# EAGLE board SteppyMk2_10x10 (EAGLE 9.2.2), part 1 of 2
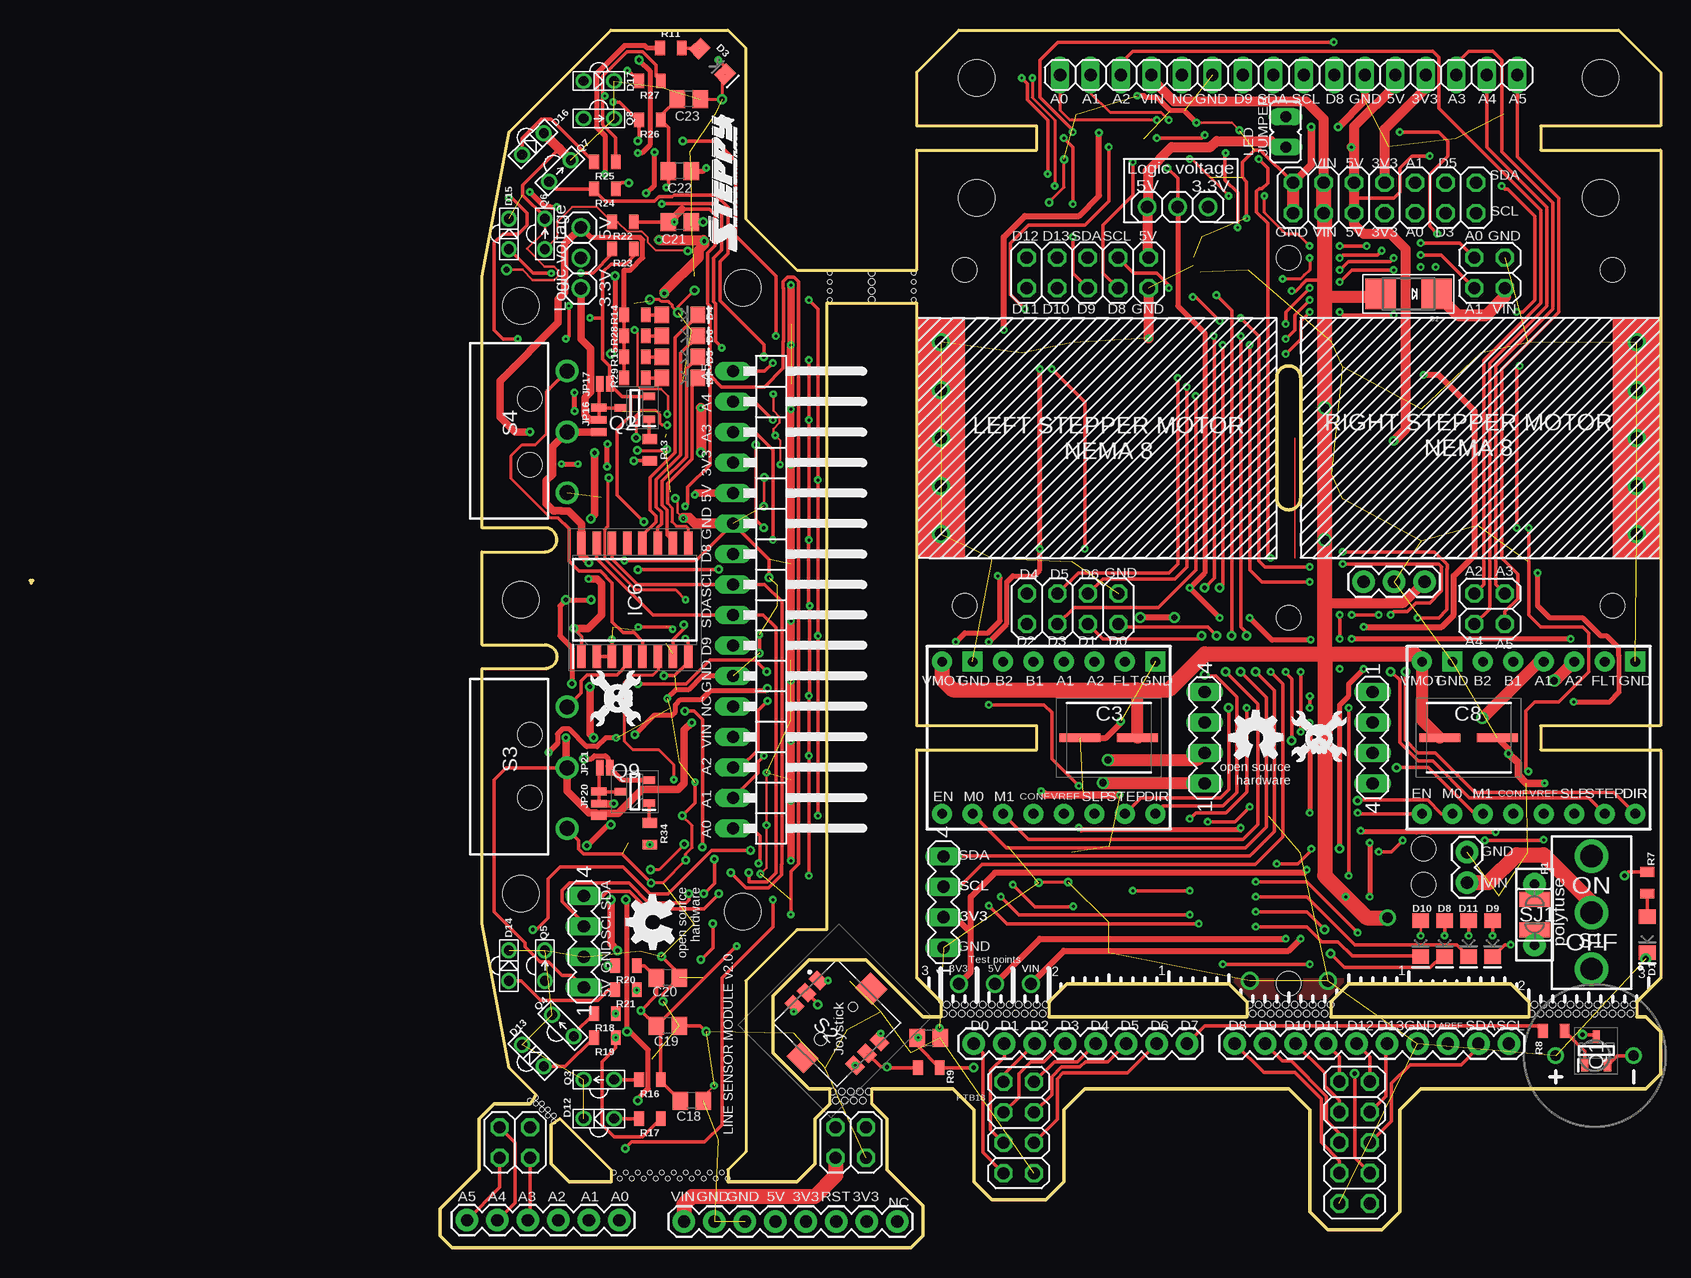
[diagram p1: board, top side]
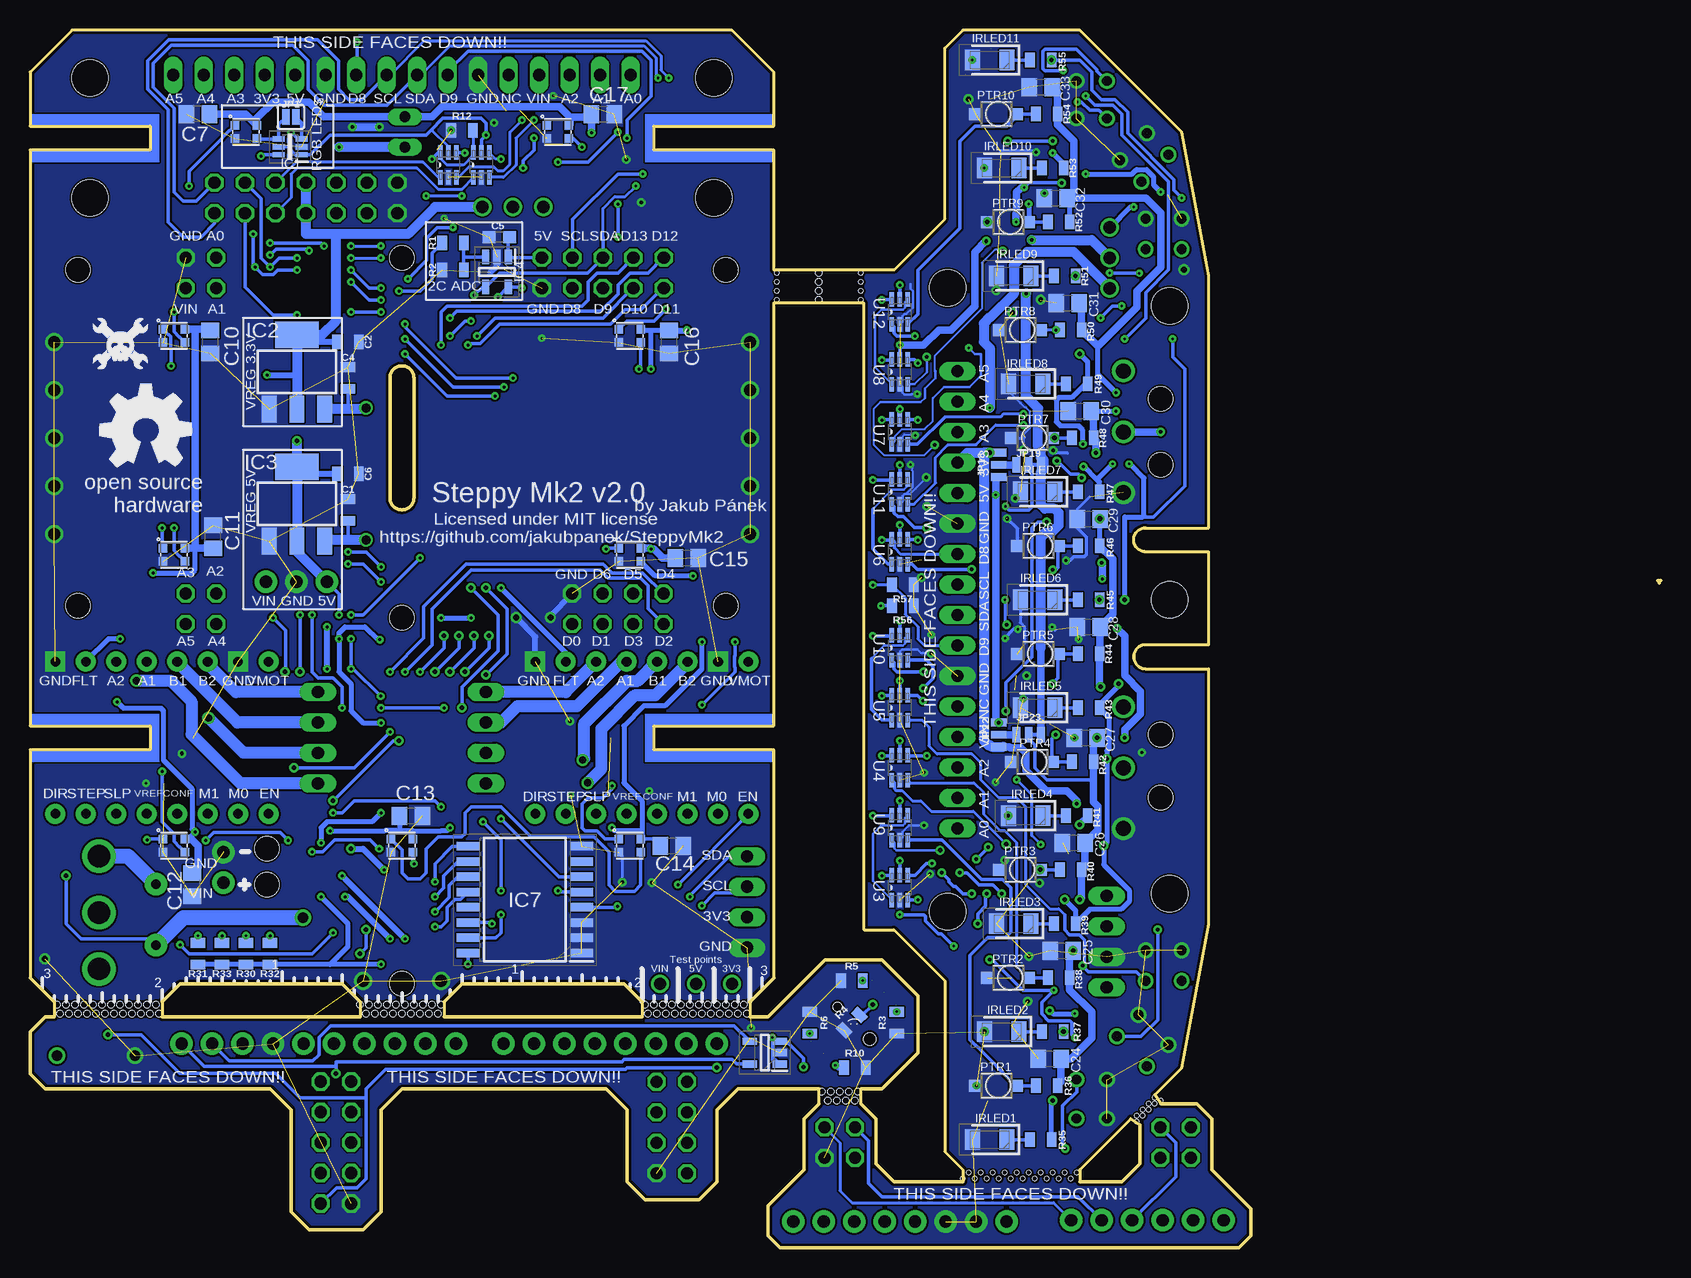
[diagram p2: board, bottom side, seen from below]

Size 135.92 x 101.5 mm. Coordinates in mm from the lower left corner, seen from the top.
Outline: 0,55.61 0.23,55.61
Outline: 0.1,55.59 0.1,55.41
Outline: 66.42,26.5 66.42,78.75 73.92,78.75 73.92,43.5 83.92,43.5 83.92,41.5 73.92,41.5 73.92,22.5 75.92,20.5 75.92,19.25 74.42,19.25 69.67,24 64.92,24 61.92,21 61.92,16.25 64.92,13.25 66.67,13.25 66.67,12 65.42,10.75 65.42,7 63.92,5.5 58.17,5.5 58.17,6.5 59.67,8 59.67,22.25 63.92,26.5 66.42,26.5
Outline: 63.92,81.5 59.67,85.75 59.67,100 58.17,101.5 48.42,101.5 39.92,93 37.67,81 37.67,60 42.92,60 arc-90 43.92,59 arc-90 42.92,58 37.67,58 37.67,50.25 42.92,50.25 arc-90 43.92,49.25 arc-90 42.92,48.25 37.67,48.25 37.67,27 39.92,15 42.17,12.75 41.67,12 38.67,12 37.42,10.75 37.42,6.5 34.17,3.25 34.17,1 35.17,0 73.42,0 74.42,1 74.42,3.5 71.42,6.5 71.42,10.75 70.17,12 70.17,13.25 76.92,13.25 78.67,11.5 78.67,5.5 80.17,4 84.67,4 86.17,5.5 86.17,11.5 87.92,13.25 104.92,13.25 106.67,11.5 106.67,3 108.17,1.5 112.67,1.5 114.17,3 114.17,11.5 115.92,13.25 134.67,13.25 135.92,14.5 135.92,18 134.67,19.25 133.92,19.25 133.92,20.5 135.92,22.5 135.92,41.5 125.92,41.5 125.92,43.5 135.92,43.5 135.92,91.5 125.92,91.5 125.92,93.5 135.92,93.5 135.92,98 132.42,101.5 77.42,101.5 73.92,98 73.92,93.5 83.92,93.5 83.92,91.5 73.92,91.5 73.92,81.5 63.92,81.5
Outline: 84.92,19.25 101.42,19.25 101.42,20.5 99.92,22 86.42,22 84.92,20.5 84.92,19.25
Outline: 108.42,19.25 124.92,19.25 124.92,20.5 123.42,22 109.92,22 108.42,20.5 108.42,19.25
Outline: 48.42,5.5 44.92,5.5 43.42,7 43.42,10.25 44.17,10.75 48.42,6.5 48.42,5.5
Outline: 103.92,62.5 103.92,72.5 arc-90 104.92,73.5 arc-90 105.92,72.5 105.92,62.5 arc-90 104.92,61.5 arc-90 103.92,62.5
Copper layers (1*16): Top 0.035mm / dielectric 1.5mm / Bottom 0.035mm
Design rules "default *": minimum track width 6mil, minimum drill 0.2mm, track to track 6mil, track to pad 6mil, pad to pad 6mil, via to via 6mil, smd to smd 6mil, copper to edge 0.2mm, drill to drill 6mil, minimum pad ring 10mil, minimum via ring 8mil, stop-mask expansion 4mil, vias tented up to drill 0mil, thermal gap 10mil
Holes 2 mm at 104.92,52.5 104.92,82.5 41.67,65.25 41.67,70.75 41.67,37.5 41.67,42.75 104.92,22 116.17,33.25 116.17,30.25 77.92,53.5 77.92,81.5 131.92,53.5 131.92,81.5
Holes 3 mm at 130.92,97.5 78.92,97.5 59.42,28 59.42,80 40.92,29.5 40.92,78.5 78.92,87.5 130.92,87.5 40.92,54
Holes 0.35 mm at 66.67,79 66.67,79.75 66.67,80.5 66.67,81.25 73.67,81.25 73.67,79 73.67,79.75 73.67,80.5 48.67,6.25 49.67,6.25 49.17,5.75 50.17,5.75 51.17,5.75 52.17,5.75 53.17,5.75 54.17,5.75 55.17,5.75 56.17,5.75 57.17,5.75 58.17,5.75 57.67,6.25 56.67,6.25 55.67,6.25 54.67,6.25 53.67,6.25 52.67,6.25 51.67,6.25 50.67,6.25 42.17,12.5 42.67,12 43.17,11.5 43.67,11 43.17,11 42.67,11.5 42.17,12 43.67,10.5 41.67,12.25
Holes 0.5 mm at 76.17,19.5 76.92,19.5 77.67,19.5 78.42,19.5 79.17,19.5 79.92,19.5 80.67,19.5 81.42,19.5 82.17,19.5 82.92,19.5 83.67,19.5 84.42,19.5 84.67,20.25 83.92,20.25 83.17,20.25 82.42,20.25 81.67,20.25 80.92,20.25 80.17,20.25 79.42,20.25 78.67,20.25 77.92,20.25 77.17,20.25 76.42,20.25 101.92,19.5 102.67,19.5 101.67,20.25 102.42,20.25 103.17,20.25 103.92,20.25 104.67,20.25 105.42,20.25 106.17,20.25 106.92,20.25 107.67,20.25 108.42,20.25 103.42,19.5 104.17,19.5 104.92,19.5 105.67,19.5 106.42,19.5 107.17,19.5 107.92,19.5 125.17,19.5 125.42,20.25 125.92,19.5 126.17,20.25 126.67,19.5 126.92,20.25 127.42,19.5 127.67,20.25 128.17,19.5 128.42,20.25 128.92,19.5 129.17,20.25 129.67,19.5 129.92,20.25 130.42,19.5 130.67,20.25 131.17,19.5 131.42,20.25 131.92,19.5 132.17,20.25 132.92,20.25 132.67,19.5 133.42,19.5 133.67,20.25 70.17,81.25 70.17,80.5 70.17,79.75 70.17,79 67.17,12.25 67.92,12.25 68.67,12.25 69.42,12.25 69.92,13 69.17,13 68.42,13 67.67,13 66.92,13

## Footprints (pad centres in the part's own frame; a part is rotated, then mirrored left to right if it is on the bottom)
0805 = smd 0.8 x 1.2: 1 -0.9,0; 2 0.9,0
CAPM7058X610N = smd 3.4 x 0.7: 1 -2.4,0; 2 2.4,0
0603 = smd 1.1 x 1: 1 -0.85,0; 2 0.85,0
C0805 = smd 1.3 x 1.5: 1 -0.95,0; 2 0.95,0
LED-1206 = smd 1.2 x 1.4: A -1.5,0; C 1.5,0
SMADIODE = smd 2.54 x 2.54: A 2.349,0; C -2.349,0
LTE-302 = drill 0.8: A 1.27,0; C -1.27,0
POLOLU-DRV8825 = drill 0.8 pad 1.676: A1 6.35,-1.27; A2 6.35,-3.81; B1 6.35,1.27; B2 6.35,3.81; CONFIG -6.35,1.27; DIR -6.35,-8.89; EN -6.35,8.89; FLT 6.35,-6.35; M0 -6.35,6.35; M1 -6.35,3.81; SLP -6.35,-3.81; STEP -6.35,-6.35; VMOT 6.35,8.89; VREF -6.35,-1.27 | drill 0.8 pad 1.676 square: GND0 6.35,6.35; GND1 6.35,-8.89
PTH = drill 0.8 pad 1.88: P$1 -2.54,0; P$2 2.54,0
SOT65P210X110-6N = smd 1 x 0.45: 1 -0.95,0.65; 2 -0.95,0; 3 -0.95,-0.65; 4 0.95,-0.65; 5 0.95,0; 6 0.95,0.65
SOT223 = smd 1.219 x 2.235: 1 -2.311,-3.099; 2 0,-3.099; 3 2.311,-3.099 | smd 3.6 x 2.2: TAB 0,3.099
SOT95P280X145-5N = smd 1.2 x 0.6: 1 -1.25,0.95; 2 -1.25,0; 3 -1.25,-0.95; 4 1.25,-0.95; 5 1.25,0.95
SOIC127P1032X265-16N = smd 1.95 x 0.7: 1 -4.725,4.445; 2 -4.725,3.175; 3 -4.725,1.905; 4 -4.725,0.635; 5 -4.725,-0.635; 6 -4.725,-1.905; 7 -4.725,-3.175; 8 -4.725,-4.445; 9 4.725,-4.445; 10 4.725,-3.175; 11 4.725,-1.905; 12 4.725,-0.635; 13 4.725,0.635; 14 4.725,1.905; 15 4.725,3.175; 16 4.725,4.445
LEDC3215X130N = smd 1.25 x 1.7: 1 -1.45,0; 2 1.45,0
1X02 = drill 1.016 pad 1.88: 1 0,0; 2 2.54,0
1X08 = drill 1.016 pad 1.88: 1 0,0; 2 2.54,0; 3 5.08,0; 4 7.62,0; 5 10.16,0; 6 12.7,0; 7 15.24,0; 8 17.78,0
1X06 = drill 1.016 pad 1.88: 1 0,0; 2 2.54,0; 3 5.08,0; 4 7.62,0; 5 10.16,0; 6 12.7,0
1X10 = drill 1.016 pad 1.88: 1 0,0; 2 2.54,0; 3 5.08,0; 4 7.62,0; 5 10.16,0; 6 12.7,0; 7 15.24,0; 8 17.78,0; 9 20.32,0; 10 22.86,0
1X03 = drill 1.016 pad 1.88: 1 0,0; 2 2.54,0; 3 5.08,0
SMT-JUMPER_2_NC_PASTE_SILK = smd 0.635 x 1.27: 1 -0.406,0; 2 0.406,0
JP1 = drill 0.914 long: 1 0,-1.27; 2 0,1.27
2X02 = drill 1.016 octagon: 1 -1.27,-1.27; 2 -1.27,1.27; 3 1.27,-1.27; 4 1.27,1.27
2X07 = drill 1.016 octagon: 1 -7.62,-1.27; 2 -7.62,1.27; 3 -5.08,-1.27; 4 -5.08,1.27; 5 -2.54,-1.27; 6 -2.54,1.27; 7 0,-1.27; 8 0,1.27; 9 2.54,-1.27; 10 2.54,1.27; 11 5.08,-1.27; 12 5.08,1.27; 13 7.62,-1.27; 14 7.62,1.27
2X05 = drill 1.016 octagon: 1 -5.08,-1.27; 2 -5.08,1.27; 3 -2.54,-1.27; 4 -2.54,1.27; 5 0,-1.27; 6 0,1.27; 7 2.54,-1.27; 8 2.54,1.27; 9 5.08,-1.27; 10 5.08,1.27
2X04 = drill 1.016 octagon: 1 -3.81,-1.27; 2 -3.81,1.27; 3 -1.27,-1.27; 4 -1.27,1.27; 5 1.27,-1.27; 6 1.27,1.27; 7 3.81,-1.27; 8 3.81,1.27
1X16/90 = drill 1.016 long: 1 -19.05,-3.81; 2 -16.51,-3.81; 3 -13.97,-3.81; 4 -11.43,-3.81; 5 -8.89,-3.81; 6 -6.35,-3.81; 7 -3.81,-3.81; 8 -1.27,-3.81; 9 1.27,-3.81; 10 3.81,-3.81; 11 6.35,-3.81; 12 8.89,-3.81; 13 11.43,-3.81; 14 13.97,-3.81; 15 16.51,-3.81; 16 19.05,-3.81
1X16 = drill 1.016 long: 1 -19.05,0; 2 -16.51,0; 3 -13.97,0; 4 -11.43,0; 5 -8.89,0; 6 -6.35,0; 7 -3.81,0; 8 -1.27,0; 9 1.27,0; 10 3.81,0; 11 6.35,0; 12 8.89,0; 13 11.43,0; 14 13.97,0; 15 16.51,0; 16 19.05,0
1X03' = drill 1.016: 1 -2.54,0; 2 0,0; 3 2.54,0
SMT-JUMPER_3_1-NC_TRACE_NO-SILK = smd 0.635 x 1.27: 1 -1.016,0; 2 0,0; 3 1.016,0
SMT-JUMPER_2_NO_NO-SILK = smd 0.635 x 1.27: 1 -0.406,0; 2 0.406,0
SMT-JUMPER_3_0-NO_TRACE_NO-SILK = smd 0.635 x 1.27: 1 -1.016,0; 2 0,0; 3 1.016,0
BUZZER-12MM-NS = drill 0.9: + 3.25,0; - -3.25,0
WS2812-2020 = smd 0.7 x 0.7: 1 0.915,-0.55; 2 0.915,0.55; 3 -0.915,0.55; 4 -0.915,-0.55
TEMT1020 = smd 1.1 x 1: 1 -1.7,0; 2 1.7,0
SOT96P237X111-3N = smd 1 x 0.6: 1 -1.2,0.955; 2 -1.2,-0.955; 3 1.2,0
LTR-301 = drill 0.8: C 1.27,0; E -1.27,0
5MS1S102AM2QES = drill 1.85 pad 2.8: 1 0,-4.7; 2 0,0; 3 0,4.7
SKRHABE010 = smd 1.35 x 1: 1 -3.575,1.425; 2 -3.575,0; 3 -3.575,-1.425; 4 3.575,1.425; 5 3.575,0; 6 3.575,-1.425 | smd 2 x 1.8: 7 0,4.05; 8 0,-4.05 | hole 0.75: 0,1.9 | hole 1.05: 0,-1.9
AH186061A = drill 1.25 pad 1.9: 1 -5.08,1.6; 2 0,1.6; 3 5.08,1.6
SJW = smd 1.27 x 2.54: 1 -1.27,0; 2 1.27,0
MA04-1 = drill 1.016 long: 1 -3.81,0; 2 -1.27,0; 3 1.27,0; 4 3.81,0
SOT65P210X110-6N' = smd 1.168 x 0.356: 1 -1.041,0.66; 2 -1.041,0; 3 -1.041,-0.66; 4 1.041,-0.66; 5 1.041,0; 6 1.041,0.66

## Placement (x,y rotation side)
C1  10uF  [0805]  109.42,61.5 90 bottom
C2  10uF  [0805]  109.42,75.5 0 bottom
C3  100UF  [CAPM7058X610N]  89.92,42.5 0 top
C4  10uF  [0805]  109.42,72.5 90 bottom
C5  0.1uF  [0603]  96.8,84.23 180 bottom
C6  10uF  [0805]  109.42,64.5 0 bottom
C7  0.1uF  [C0805]  121.92,94.5 180 bottom
C8  100UF  [CAPM7058X610N]  119.92,42.5 180 top
C9  0.1uF  [C0805]  74.92,17.5 0 top
C10  0.1uF  [C0805]  120.92,75.5 270 bottom
C11  0.1uF  [C0805]  120.67,59.25 90 bottom
C12  0.1uF  [C0805]  122.42,30.25 270 bottom
C13  0.1uF  [C0805]  104.17,36 0 bottom
C14  0.1uF  [C0805]  82.42,33.5 0 bottom
C15  0.1uF  [C0805]  81.17,57.5 0 bottom
C16  0.1uF  [C0805]  82.67,75.5 270 bottom
C17  0.1uF  [C0805]  88.17,94.5 0 bottom
C18  [C0805]  55.17,12.25 180 top
C19  [C0805]  53.17,18.5 180 top
C20  [C0805]  53.17,22.5 180 top
C21  [C0805]  54.17,85.5 180 top
C22  [C0805]  54.17,89.75 180 top
C23  [C0805]  54.92,95.75 180 top
C24  [C0805]  50.92,15.75 0 bottom
C25  [C0805]  49.92,24.75 0 bottom
C26  [C0805]  48.92,33.75 0 bottom
C27  [C0805]  47.92,42.5 0 bottom
C28  [C0805]  47.67,51.75 0 bottom
C29  [C0805]  47.67,60.75 0 bottom
C30  [C0805]  48.42,69.75 0 bottom
C31  [C0805]  49.42,78.75 0 bottom
C32  [C0805]  50.42,87.5 0 bottom
C33  [C0805]  51.67,96.75 0 bottom
D1  GREEN  [LED-1206]  134.82,26.1 270 top
D2  [SMADIODE]  114.92,79.5 180 top
D3  GREEN  [LED-1206]  56.87,98.89 315 top
D4  GREEN  [LED-1206]  54.17,77.75 0 top
D5  GREEN  [LED-1206]  54.17,74.25 0 top
D6  GREEN  [LED-1206]  54.17,76 0 top
D7  GREEN  [LED-1206]  54.17,72.5 0 top
D8  GREEN  [LED-1206]  117.92,25.75 270 top
D9  GREEN  [LED-1206]  121.92,25.75 270 top
D10  GREEN  [LED-1206]  115.92,25.75 270 top
D11  GREEN  [LED-1206]  119.92,25.75 270 top
D12  [LTE-302]  47.42,10.75 0 top
D13  [LTE-302]  41.92,16 315 top
D14  [LTE-302]  39.92,23.5 270 top
D15  [LTE-302]  39.92,84.5 270 top
D16  [LTE-302]  41.92,92 225 top
D17  [LTE-302]  47.42,97.25 180 top
DRV1  POLOLU-DRV8825  [POLOLU-DRV8825]  124.92,42.5 90 top
DRV2  POLOLU-DRV8825  [POLOLU-DRV8825]  84.92,42.5 90 top
F1  [PTH]  125.42,27.75 270 top
GOLD_ORB_SM1  OSHWLOGOLOGO8MM  [OSHW_8MM]  126.29,68.12 0 bottom
GOLD_ORB_SM2  OSHWLOGOLOGO5MM  [OSHW_5MM]  102.17,42.5 0 top
GOLD_ORB_SM3  OSHWLOGOLOGO5MM  [OSHW_5MM]  51.92,27.12 90 top
IC1  74LVC1T45GW,125  [SOT65P210X110-6N]  114.24,91.76 180 bottom
IC2  AP1117E33G-13  [SOT223]  113.67,73 0 bottom
IC3  TS1117BCW-5.0  [SOT223]  113.67,62 0 bottom
IC4  MCP3021A0T-E_OT  [SOT95P280X145-5N]  97,81.33 270 bottom
IC5  MCP3021A1T-E_OT  [SOT95P280X145-5N]  74.67,16.25 180 bottom
IC6  PCF8574T_3,518  [SOIC127P1032X265-16N]  50.42,54 90 top
IC7  PCF8574T_3,518  [SOIC127P1032X265-16N]  94.67,29 180 bottom
IRLED1  LL-S150IRC-2A  [LEDC3215X130N]  55.92,9 180 bottom
IRLED2  LL-S150IRC-2A  [LEDC3215X130N]  54.92,18 180 bottom
IRLED3  LL-S150IRC-2A  [LEDC3215X130N]  53.92,27 180 bottom
IRLED4  LL-S150IRC-2A  [LEDC3215X130N]  52.92,36 180 bottom
IRLED5  LL-S150IRC-2A  [LEDC3215X130N]  51.92,45 180 bottom
IRLED6  LL-S150IRC-2A  [LEDC3215X130N]  51.92,54 180 bottom
IRLED7  LL-S150IRC-2A  [LEDC3215X130N]  51.92,63 180 bottom
IRLED8  LL-S150IRC-2A  [LEDC3215X130N]  52.92,72 180 bottom
IRLED9  LL-S150IRC-2A  [LEDC3215X130N]  53.92,81 180 bottom
IRLED10  LL-S150IRC-2A  [LEDC3215X130N]  54.92,90 180 bottom
IRLED11  LL-S150IRC-2A  [LEDC3215X130N]  55.92,99 180 bottom
J1  [1X02]  119.79,32.96 270 top
J2  [1X08]  72.3,2.16 180 top
J3  [1X06]  49.13,2.28 180 top
J4  [1X10]  100.42,17 0 top
J5  [1X08]  78.67,17 0 top
J6  455-1750-1-ND  [1X03]  111.17,55.5 0 top
JP1  JUMPER-SMT_2_NC_PASTE_SILK  [SMT-JUMPER_2_NC_PASTE_SILK]  114.17,94.25 180 bottom
JP2  [JP1]  104.67,93 180 top
JP3  [2X02]  68.42,8.75 180 top
JP4  [2X02]  40.42,8.75 180 top
JP5  [2X07]  112.92,87.5 180 top
JP6  [2X05]  110.42,8.75 90 top
JP7  [2X04]  82.42,10 90 top
JP8  [2X02]  121.67,81.25 270 top
JP9  [2X02]  121.67,53.25 270 top
JP10  [2X05]  88.17,81.25 180 top
JP11  [2X04]  86.92,53.25 180 top
JP12  [1X16/90]  62.42,54 270 top
JP13  [1X16]  104.92,97.75 0 top
JP14  [1X03']  45.92,82.5 90 top
JP15  [1X03']  95.67,86.75 180 top
JP16  JUMPER-SMT_3_1-NC_TRACE_NO-SILK  [SMT-JUMPER_3_1-NC_TRACE_NO-SILK]  47.42,69 90 top
JP17  JUMPER-SMT_2_NO_NO-SILK  [SMT-JUMPER_2_NO_NO-SILK]  47.92,72 180 top
JP18  JUMPER-SMT_3_NO_NO_SILK  [SMT-JUMPER_3_0-NO_TRACE_NO-SILK]  55.17,65.25 90 bottom
JP19  JUMPER-SMT_3_1-NC_TRACE_NO-SILK  [SMT-JUMPER_3_1-NC_TRACE_NO-SILK]  52.67,65.25 0 bottom
JP20  JUMPER-SMT_3_1-NC_TRACE_NO-SILK  [SMT-JUMPER_3_1-NC_TRACE_NO-SILK]  47.42,37 90 top
JP21  JUMPER-SMT_2_NO_NO-SILK  [SMT-JUMPER_2_NO_NO-SILK]  47.92,40 180 top
JP22  JUMPER-SMT_3_NO_NO_SILK  [SMT-JUMPER_3_0-NO_TRACE_NO-SILK]  55.17,42.75 270 bottom
JP23  JUMPER-SMT_3_1-NC_TRACE_NO-SILK  [SMT-JUMPER_3_1-NC_TRACE_NO-SILK]  52.67,42.75 0 bottom
LS1  BUZZER-PTH_NO_SILK  [BUZZER-12MM-NS]  130.42,16 180 top
PLED1  WS2812-2020  [WS2812-2020]  117.92,93 180 bottom
PLED2  WS2812-2020  [WS2812-2020]  123.92,76 180 bottom
PLED3  WS2812-2020  [WS2812-2020]  123.92,57.75 180 bottom
PLED4  WS2812-2020  [WS2812-2020]  123.92,33.5 180 bottom
PLED5  WS2812-2020  [WS2812-2020]  104.92,33.5 180 bottom
PLED6  WS2812-2020  [WS2812-2020]  85.92,33.5 180 bottom
PLED7  WS2812-2020  [WS2812-2020]  85.92,57.75 180 bottom
PLED8  WS2812-2020  [WS2812-2020]  85.92,76 180 bottom
PLED9  WS2812-2020  [WS2812-2020]  91.92,93 180 bottom
PTR1  TEMT1020  [TEMT1020]  55.42,13.5 180 bottom
PTR2  TEMT1020  [TEMT1020]  54.42,22.5 180 bottom
PTR3  TEMT1020  [TEMT1020]  53.42,31.5 180 bottom
PTR4  TEMT1020  [TEMT1020]  52.42,40.5 180 bottom
PTR5  TEMT1020  [TEMT1020]  51.92,49.5 180 bottom
PTR6  TEMT1020  [TEMT1020]  51.92,58.5 180 bottom
PTR7  TEMT1020  [TEMT1020]  52.42,67.5 180 bottom
PTR8  TEMT1020  [TEMT1020]  53.42,76.5 180 bottom
PTR9  TEMT1020  [TEMT1020]  54.42,85.5 180 bottom
PTR10  TEMT1020  [TEMT1020]  55.42,94.5 180 bottom
Q1  SBC817-40LT1G  [SOT96P237X111-3N]  130.55,16.4 90 top
Q2  SBC817-40LT1G  [SOT96P237X111-3N]  50.42,70 180 top
Q3  [LTR-301]  47.42,14 0 top
Q4  [LTR-301]  44.42,18.5 315 top
Q5  [LTR-301]  42.92,23.5 270 top
Q6  [LTR-301]  42.92,84.5 270 top
Q7  [LTR-301]  44.17,89.75 225 top
Q8  [LTR-301]  47.42,94.12 180 top
Q9  SBC817-40LT1G  [SOT96P237X111-3N]  50.42,38 180 top
R1  10K  [0805]  100.67,83.75 0 bottom
R2  10K  [0805]  100.67,81.5 180 bottom
R3  8k2  [0805]  63.67,18.75 90 bottom
R4  4k7  [0805]  67.42,18.75 45 bottom
R5  2k  [0805]  67.42,22.25 0 bottom
R6  16k  [0805]  70.92,18.75 270 bottom
R7  4K7  [0805]  134.81,30.41 270 top
R8  4.7K  [0805]  127,18.06 180 top
R9  1M  [0805]  74.92,15 0 top
R10  33k  [0805]  67.17,15 0 bottom
R11  330  [0805]  53.42,100 0 top
R12  330K  [0805]  99.92,93.12 0 bottom
R13  4.7K  [0805]  51.67,66.5 270 top
R14  4k7  [0805]  50.42,77.75 0 top
R15  4k7  [0805]  50.42,74.25 0 top
R16  10K  [0805]  51.67,14 180 top
R17  330  [0805]  51.67,10.75 180 top
R18  10K  [0805]  47.92,19.5 180 top
R19  330  [0805]  47.92,17.5 180 top
R20  10K  [0805]  49.67,23.5 180 top
R21  330  [0805]  49.67,21.5 180 top
R22  10K  [0805]  49.42,85.5 180 top
R23  330  [0805]  49.42,83.25 180 top
R24  10K  [0805]  47.92,88.25 180 top
R25  330  [0805]  47.92,90.5 180 top
R26  10K  [0805]  51.67,94 180 top
R27  330  [0805]  51.67,97.25 180 top
R28  4k7  [0805]  50.42,76 0 top
R29  4k7  [0805]  50.42,72.5 0 top
R30  4k7  [0805]  117.92,24.5 90 bottom
R31  4k7  [0805]  121.92,24.5 90 bottom
R32  4k7  [0805]  115.92,24.5 90 bottom
R33  4k7  [0805]  119.92,24.5 90 bottom
R34  4.7K  [0805]  51.67,34.5 270 top
R35  330  [0805]  51.67,9 180 bottom
R36  10K  [0805]  51.17,13.5 180 bottom
R37  330  [0805]  50.67,18 180 bottom
R38  10K  [0805]  50.17,22.5 180 bottom
R39  330  [0805]  49.67,27 180 bottom
R40  10K  [0805]  49.17,31.5 180 bottom
R41  330  [0805]  48.67,36 180 bottom
R42  10K  [0805]  48.17,40.5 180 bottom
R43  330  [0805]  47.67,45 180 bottom
R44  10K  [0805]  47.67,49.5 180 bottom
R45  330  [0805]  47.67,54 180 bottom
R46  10K  [0805]  47.67,58.5 180 bottom
R47  330  [0805]  47.67,63 180 bottom
R48  10K  [0805]  48.17,67.5 180 bottom
R49  330  [0805]  48.67,72 180 bottom
R50  10K  [0805]  49.17,76.5 180 bottom
R51  330  [0805]  49.67,81 180 bottom
R52  10K  [0805]  50.17,85.5 180 bottom
R53  330  [0805]  50.67,90 180 bottom
R54  10K  [0805]  51.17,94.5 180 bottom
R55  330  [0805]  51.67,99 180 bottom
R56  330K  [0805]  63.17,53.5 180 bottom
R57  330K  [0805]  63.17,55.25 180 bottom
S1  5MS1S102AM2QES  [5MS1S102AM2QES]  130.16,27.92 0 top
S2  SKRHABE010  [SKRHABE010]  67.26,18.72 315 top
S3  AH186061A  [AH186061A]  43.17,40 270 top
S4  AH186061A  [AH186061A]  43.17,68 270 top
SJ1  [SJW]  125.42,27.75 270 top
SV1  [MA04-1]  111.92,42.5 270 top
SV2  [MA04-1]  97.92,42.5 90 top
SV3  [MA04-1]  76.15,28.81 90 top
SV4  [MA04-1]  46.17,25.5 90 top
U1  NC7SB3157P6X  [SOT65P210X110-6N']  98.29,90.25 90 bottom
U2  NC7SB3157P6X  [SOT65P210X110-6N']  101.04,90.25 90 bottom
U3  NC7SB3157P6X  [SOT65P210X110-6N']  63.42,30 90 bottom
U4  NC7SB3157P6X  [SOT65P210X110-6N']  63.42,40 90 bottom
U5  NC7SB3157P6X  [SOT65P210X110-6N']  63.42,45 90 bottom
U6  NC7SB3157P6X  [SOT65P210X110-6N']  63.42,58 90 bottom
U7  NC7SB3157P6X  [SOT65P210X110-6N']  63.42,68 90 bottom
U8  NC7SB3157P6X  [SOT65P210X110-6N']  63.42,73 90 bottom
U9  NC7SB3157P6X  [SOT65P210X110-6N']  63.42,35 90 bottom
U10  NC7SB3157P6X  [SOT65P210X110-6N']  63.42,50 90 bottom
U11  NC7SB3157P6X  [SOT65P210X110-6N']  63.42,63 90 bottom
U12  NC7SB3157P6X  [SOT65P210X110-6N']  63.42,78 90 bottom